# Altium project MP3_RS485.PrjPcb
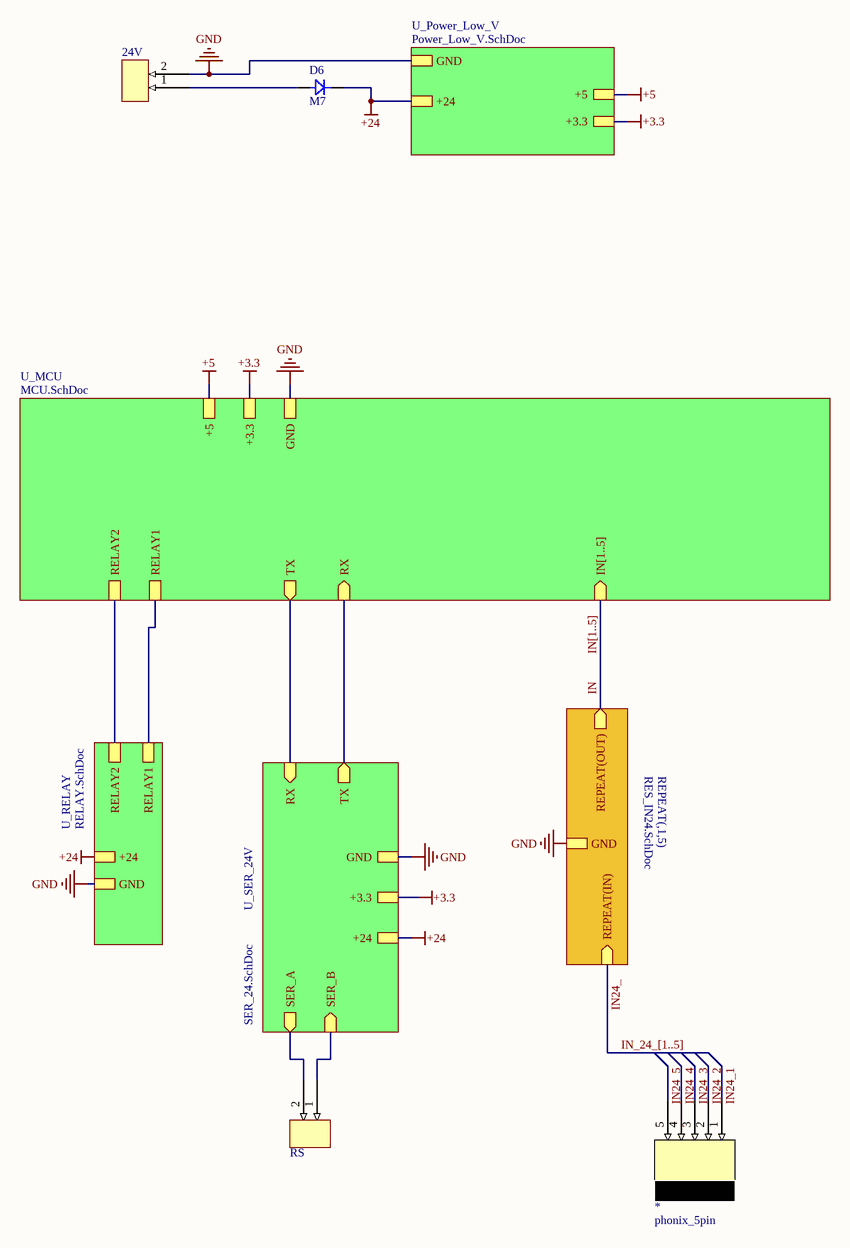
[diagram p0: Multi.SchDoc]
7 sheets, 124 parts. Net scope: hierarchical (ports join the sheet entries above them; power ports are global).
Board file: MP3_RS485.PcbDoc
Sheets:
  Multi.SchDoc
    1 = RES_IN24.SchDoc
    2 = RES_IN24.SchDoc
    3 = RES_IN24.SchDoc
    4 = RES_IN24.SchDoc
    5 = RES_IN24.SchDoc
    U_SER_24V = SER_24.SchDoc
    U_MCU = MCU.SchDoc
      U_MP3 = MP3.SchDoc
    U_Power_Low_V = Power_Low_V.SchDoc
    U_RELAY = RELAY.SchDoc

## Sheet Multi.SchDoc
size 254 x 330 mm

### Parts
24V  (no value)  [CONECTOR/FONIX/2PIN]
D6  M7  [DIOD/1N4007/SMD]
IN  phonix_5pin  [phonix_5pin]
RS  (no value)  [CONECTOR/FONIX/2PIN]

### Sub-sheets
REPEAT(,1,5) = RES_IN24.SchDoc: GND, REPEAT(IN) (in), REPEAT(OUT) (out)
U_MCU = MCU.SchDoc: GND, +5, +3.3, IN[1..5] (in), RX (in), TX (out), RELAY1, RELAY2
U_Power_Low_V = Power_Low_V.SchDoc: GND, +24, +3.3, +5
U_RELAY = RELAY.SchDoc: RELAY1, RELAY2, GND, +24
U_SER_24V = SER_24.SchDoc: SER_A (out), GND, +24, +3.3, TX (out), RX (in), SER_B (in)

### Nets
+3.3: sheet U_SER_24V/+3.3, sheet U_MCU/+3.3, sheet U_Power_Low_V/+3.3
+5: sheet U_MCU/+5, sheet U_Power_Low_V/+5
+24: D6.K ; sheet U_SER_24V/+24, sheet U_Power_Low_V/+24, sheet U_RELAY/+24
GND: 24V.2 ; sheet REPEAT(,1,5)/GND, sheet U_SER_24V/GND, sheet U_MCU/GND, sheet U_Power_Low_V/GND, sheet U_RELAY/GND
IN: sheet REPEAT(,1,5)/REPEAT(OUT)
IN24_: sheet REPEAT(,1,5)/REPEAT(IN)
IN24_1: IN.1
IN24_2: IN.2
IN24_3: IN.3
IN24_4: IN.4
IN24_5: IN.5
RELAY1: sheet U_MCU/RELAY1, sheet U_RELAY/RELAY1
RELAY2: sheet U_MCU/RELAY2, sheet U_RELAY/RELAY2
RX1: sheet U_SER_24V/TX, sheet U_MCU/RX
SER_A: RS.2 ; sheet U_SER_24V/SER_A
SER_B: RS.1 ; sheet U_SER_24V/SER_B
TX1: sheet U_SER_24V/RX, sheet U_MCU/TX
Net24V_1: 24V.1 D6.A

### Buses and harness runs
bus IN[1..5] = sheet U_MCU/IN[1..5]
bus IN_24_[1..5]

### Library data of the parts
24V RS = CONECTOR/FONIX/2PIN
D6 = DIOD/RECTIFIERS

## Sheet RES_IN24.SchDoc
size 127 x 127 mm
Used 5 times, as channels 1, 2, 3, 4, 5. Parts and nets are listed once, with the designators drawn on the sheet.
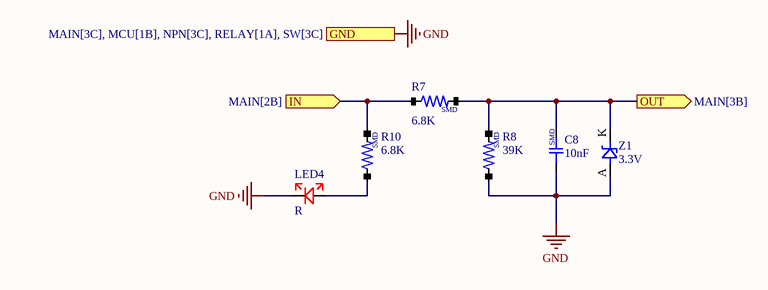
[diagram p1: RES_IN24.SchDoc]

### Parts
C8  10nF  [CAP-0603]
LED4  R  [LED/0805]
R7  6.8K  [RES/0805]
R8  39K  [RES/0805]
R10  6.8K  [RES/0805]
Z1  3.3V  [mini_melf]

### Ports
GND (see MAIN[3C], MCU[1B], NPN[3C], RELAY[1A], SW[3C]), IN (in, see MAIN[2B]), OUT (out, see MAIN[3B])

### Nets
GND: C8.1 LED4.K R8.1 Z1.A ; port GND
IN: R7.1 R10.2 ; port IN
OUT: C8.2 R7.2 R8.2 Z1.K ; port OUT
NetLED4_A: LED4.A R10.1

### Channels
1: designators end in _1; ports GND=GND IN=IN24_1 OUT=IN1
2: designators end in _2; ports GND=GND IN=IN24_2 OUT=IN2
3: designators end in _3; ports GND=GND IN=IN24_3 OUT=IN3
4: designators end in _4; ports GND=GND IN=IN24_4 OUT=IN4
5: designators end in _5; ports GND=GND IN=IN24_5 OUT=IN5

### Notes on the sheet
- (in symbol cap_smd) SMD
- (in symbol RES/SMD) SMD

### Library data of the parts
C8 = cap_smd
LED4 = LED-1COLER
R7 R8 R10 = RES/SMD
Z1 = zener-0.5w

## Sheet SER_24.SchDoc
size A
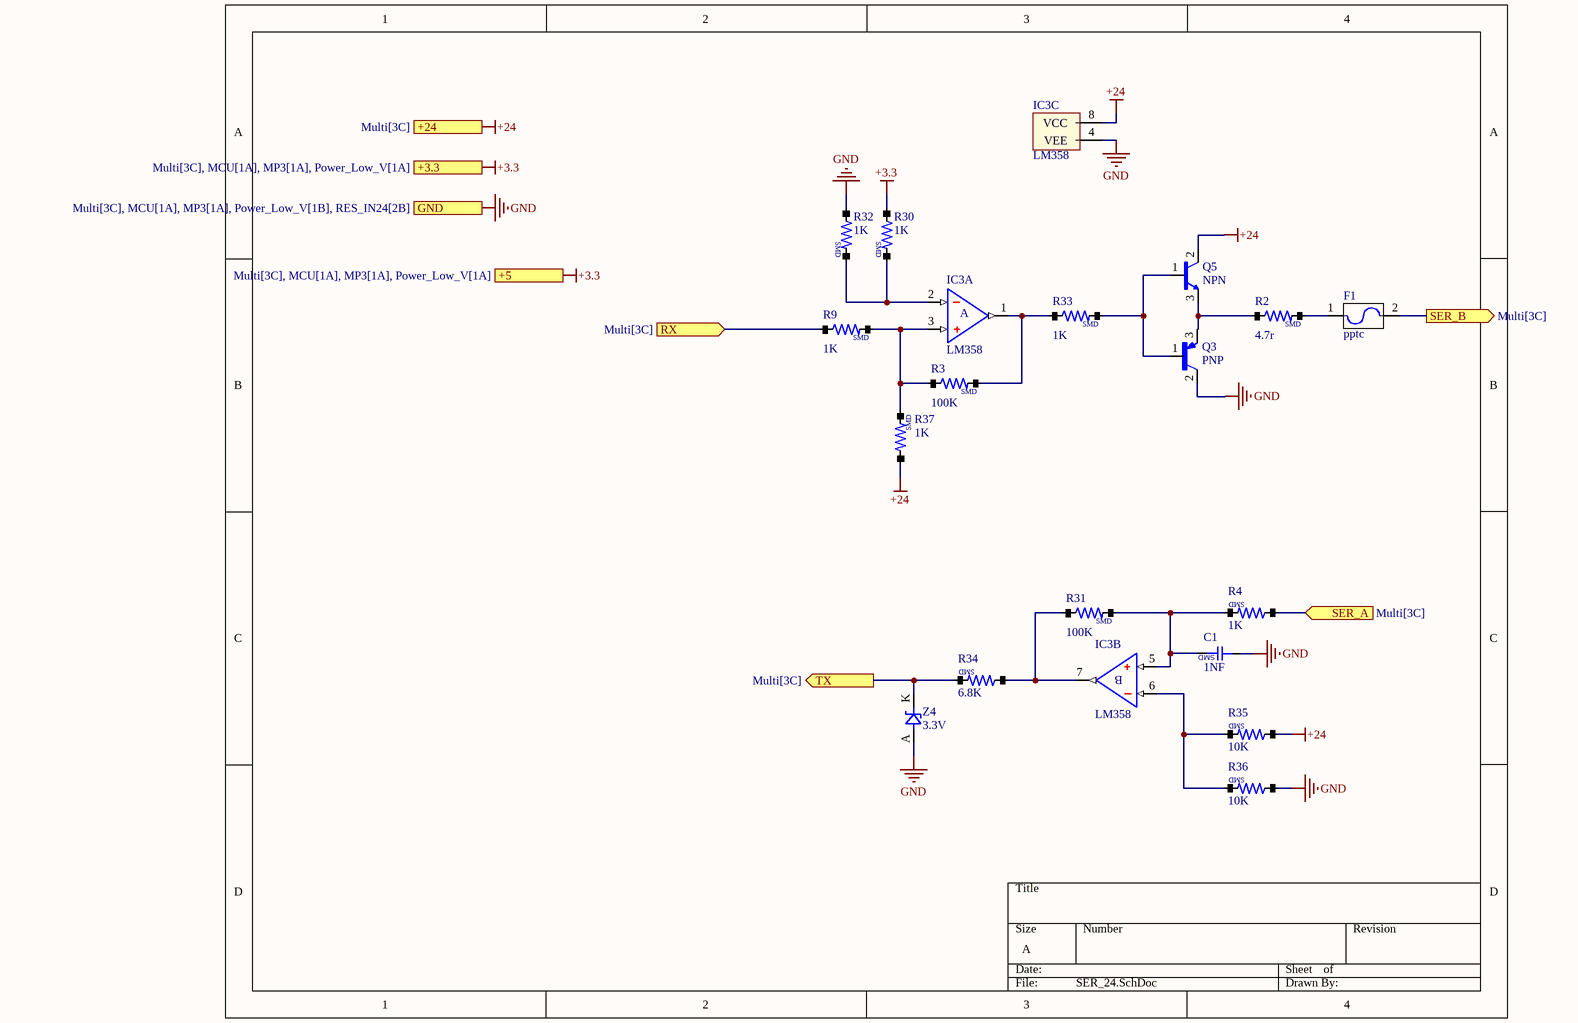
[diagram p2: SER_24.SchDoc]

### Parts
C1  1NF  [CAP-0603]
F1  pptc  [PPTC]
IC3  LM358  [SOP-8]  (parts A,B,C of 3)
Q3  PNP  [SOT-89]
Q5  NPN  [SOT-89]
R2  4.7r  [RES/0805]
R3  100K  [RES/0603]
R4  1K  [RES/0603]
R9  1K  [RES/0603]
R30  1K  [RES/0603]
R31  100K  [RES/0603]
R32  1K  [RES/0603]
R33  1K  [RES/0603]
R34  6.8K  [RES/0805]
R35  10K  [RES/0603]
R36  10K  [RES/0603]
R37  1K  [RES/0603]
Z4  3.3V  [DIOD/RS1J]

### Ports
+3.3 (see Multi[3C], MCU[1A], MP3[1A], Power_Low_V[1A]), +5 (see Multi[3C], MCU[1A], MP3[1A], Power_Low_V[1A]), +24 (see Multi[3C]), GND (see Multi[3C], MCU[1A], MP3[1A], Power_Low_V[1B], RES_IN24[2B]), RX (in, see Multi[3C]), SER_A (in, see Multi[3C]), SER_B (out, see Multi[3C]), TX (out, see Multi[3C])

### Nets
+3.3: R30.1 ; port +3.3, port +5
+24: IC3.8(VCC) Q5.2(C) R35.1 R37.1 ; port +24
GND: C1.1 IC3.4(VEE) Q3.2(C) R32.1 R36.1 Z4.A ; port GND
RX1: R34.2 Z4.K ; port TX
SER_A: R4.1 ; port SER_A
SER_B: F1.2 ; port SER_B
TX1: R9.1 ; port RX
NetC1_2: C1.2 IC3.5 R4.2 R31.2
NetF1_1: F1.1 R2.2
NetIC3_1: IC3.1 R3.2 R33.1
NetIC3_2: IC3.2 R30.2 R32.2
NetIC3_3: IC3.3 R3.1 R9.2 R37.2
NetIC3_6: IC3.6 R35.2 R36.2
NetIC3_7: IC3.7 R31.1 R34.1
NetQ3_1: Q3.1(B) Q5.1(B) R33.2
NetQ3_3: Q3.3(E) Q5.3(E) R2.1

### Notes on the sheet
- (in symbol cap_smd) SMD
- (in symbol LM358, part A) A
- (in symbol LM358, part B) B
- (in symbol RES/SMD) SMD

### Library data of the parts
C1 = cap_smd
F1 = fuze
R2-R4 R9 R30-R37 = RES/SMD
Z4 = zener-0.5w

## Sheet MCU.SchDoc
size 304 x 254 mm
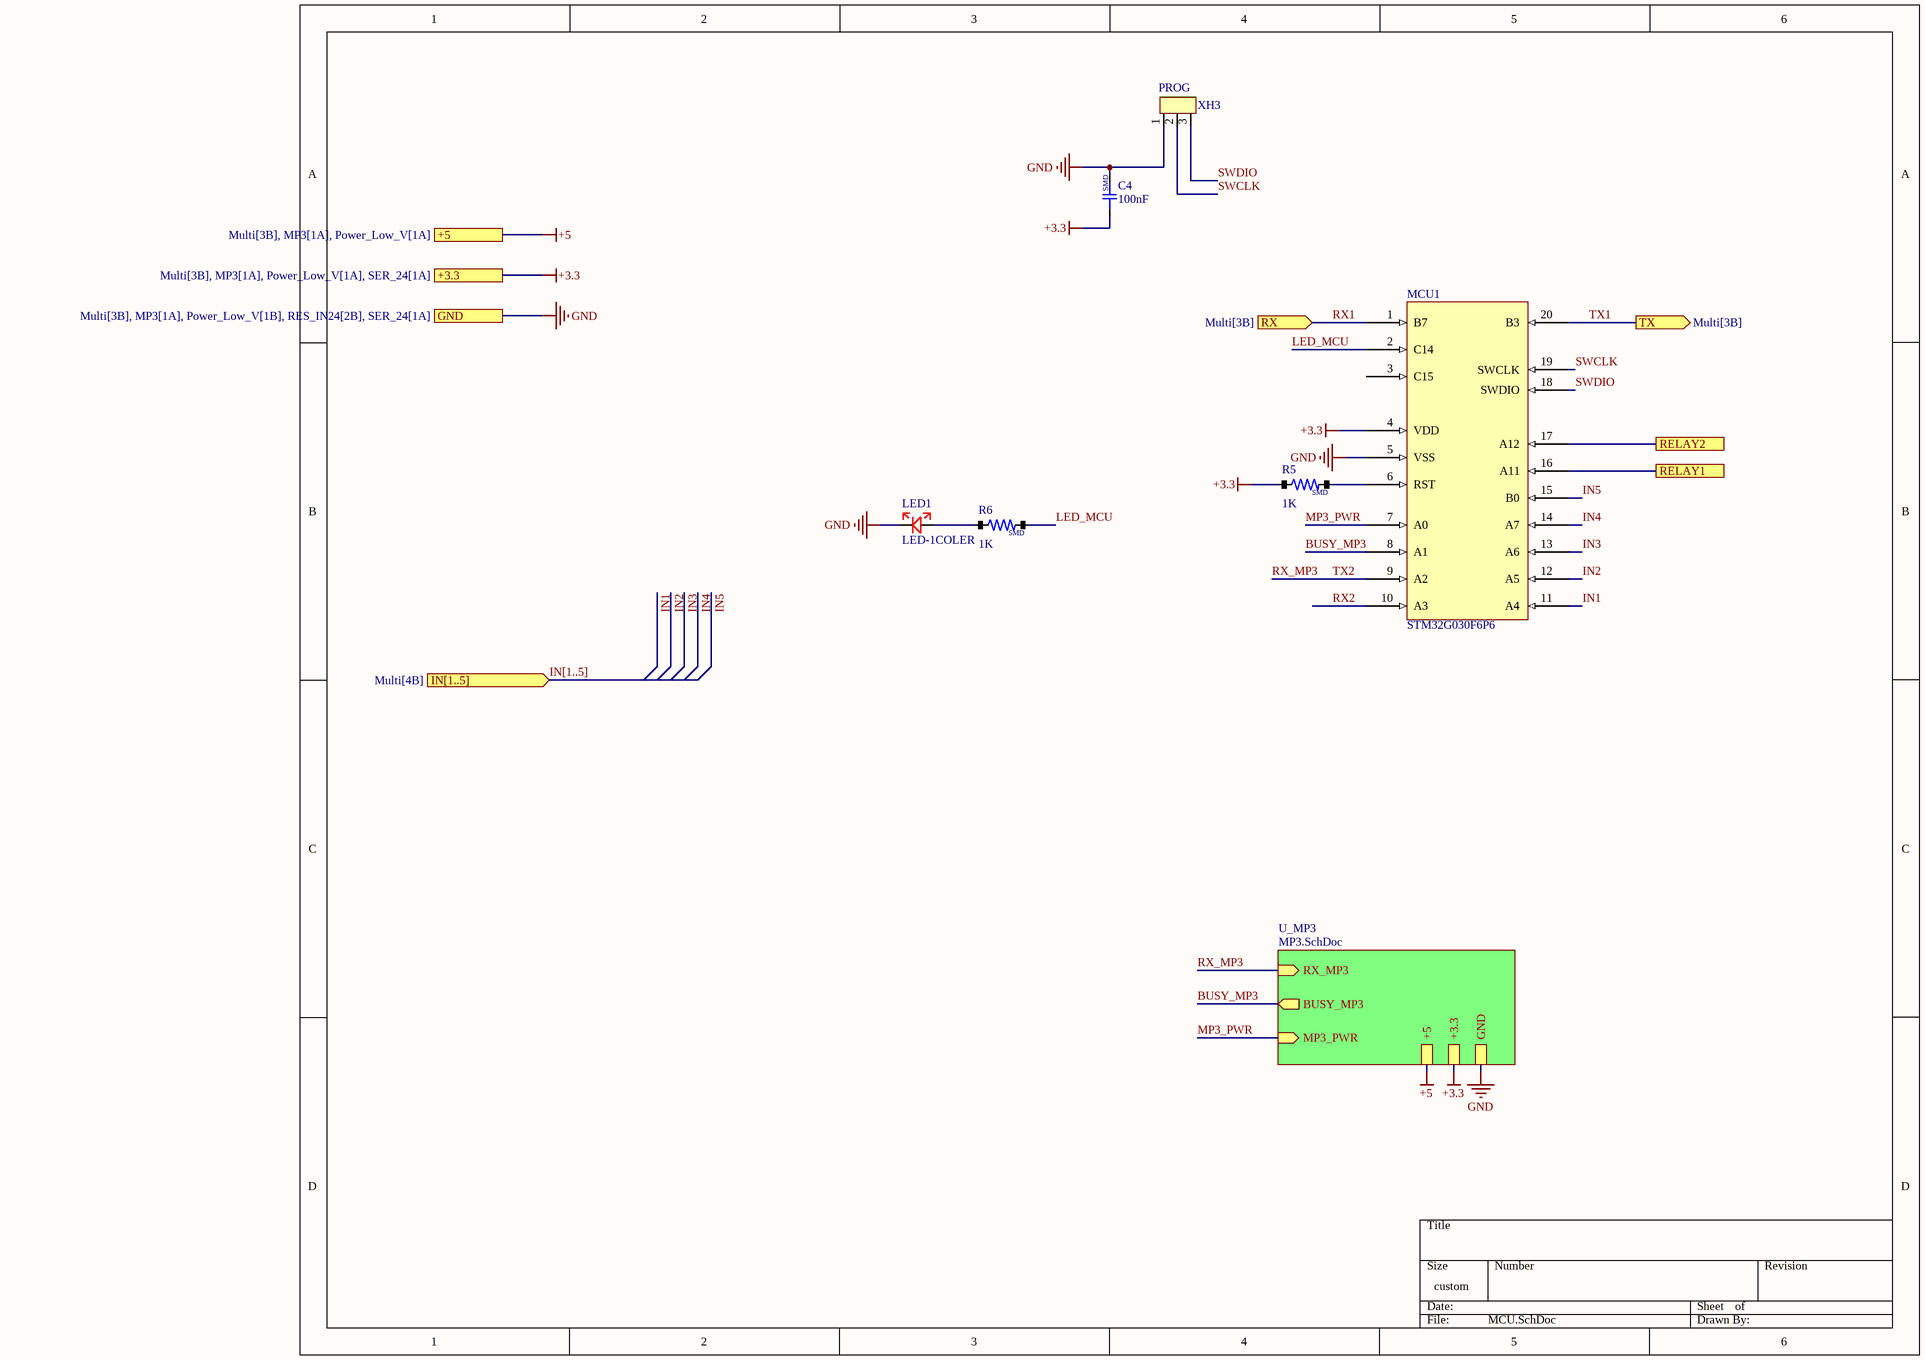
[diagram p3: MCU.SchDoc]

### Parts
C4  100nF  [CAP-0603]
LED1  LED-1COLER  [LED/0805]
MCU1  STM32G030F6P6  [stm32G030F6P6]
PROG  XH3  [XH3]
R5  1K  [RES/0603]
R6  1K  [RES/0603]

### Sub-sheets
U_MP3 = MP3.SchDoc: +3.3, GND, +5, MP3_PWR (in), RX_MP3 (in), BUSY_MP3 (out)

### Ports
+3.3 (see Multi[3B], MP3[1A], Power_Low_V[1A], SER_24[1A]), +5 (see Multi[3B], MP3[1A], Power_Low_V[1A]), GND (see Multi[3B], MP3[1A], Power_Low_V[1B], RES_IN24[2B], SER_24[1A]), IN[1..5] (in, see Multi[4B]), RELAY1, RELAY2, RX (in, see Multi[3B]), TX (out, see Multi[3B])

### Nets
+3.3: C4.1 MCU1.4(VDD) R5.1 ; port +3.3, sheet U_MP3/+3.3
+5: port +5, sheet U_MP3/+5
GND: C4.2 LED1.K MCU1.5(VSS) PROG.1 ; port GND, sheet U_MP3/GND
BUSY_MP3: MCU1.8(A1) ; sheet U_MP3/BUSY_MP3
IN1: MCU1.11(A4)
IN2: MCU1.12(A5)
IN3: MCU1.13(A6)
IN4: MCU1.14(A7)
IN5: MCU1.15(B0)
LED_MCU: MCU1.2(C14) R6.2
MP3_PWR: MCU1.7(A0) ; sheet U_MP3/MP3_PWR
RELAY1: MCU1.16(A11) ; port RELAY1
RELAY2: MCU1.17(A12) ; port RELAY2
RX1: MCU1.1(B7) ; port RX
RX2: MCU1.10(A3)
RX_MP3: MCU1.9(A2) ; sheet U_MP3/RX_MP3  [also labelled TX2]
SWCLK: MCU1.19(SWCLK) PROG.2
SWDIO: MCU1.18(SWDIO) PROG.3
TX1: MCU1.20(B3) ; port TX
NetLED1_A: LED1.A R6.1
NetMCU1_6: MCU1.6(RST) R5.2

Not connected (* = marked no-connect by the designer): MCU1 3(C15)

### Buses and harness runs
bus IN[1..5] = port IN[1..5]

### Notes on the sheet
- (in symbol cap_smd) SMD
- (in symbol RES/SMD) SMD

### Library data of the parts
C4 = cap_smd
R5 R6 = RES/SMD

## Sheet MP3.SchDoc
size 381 x 241 mm
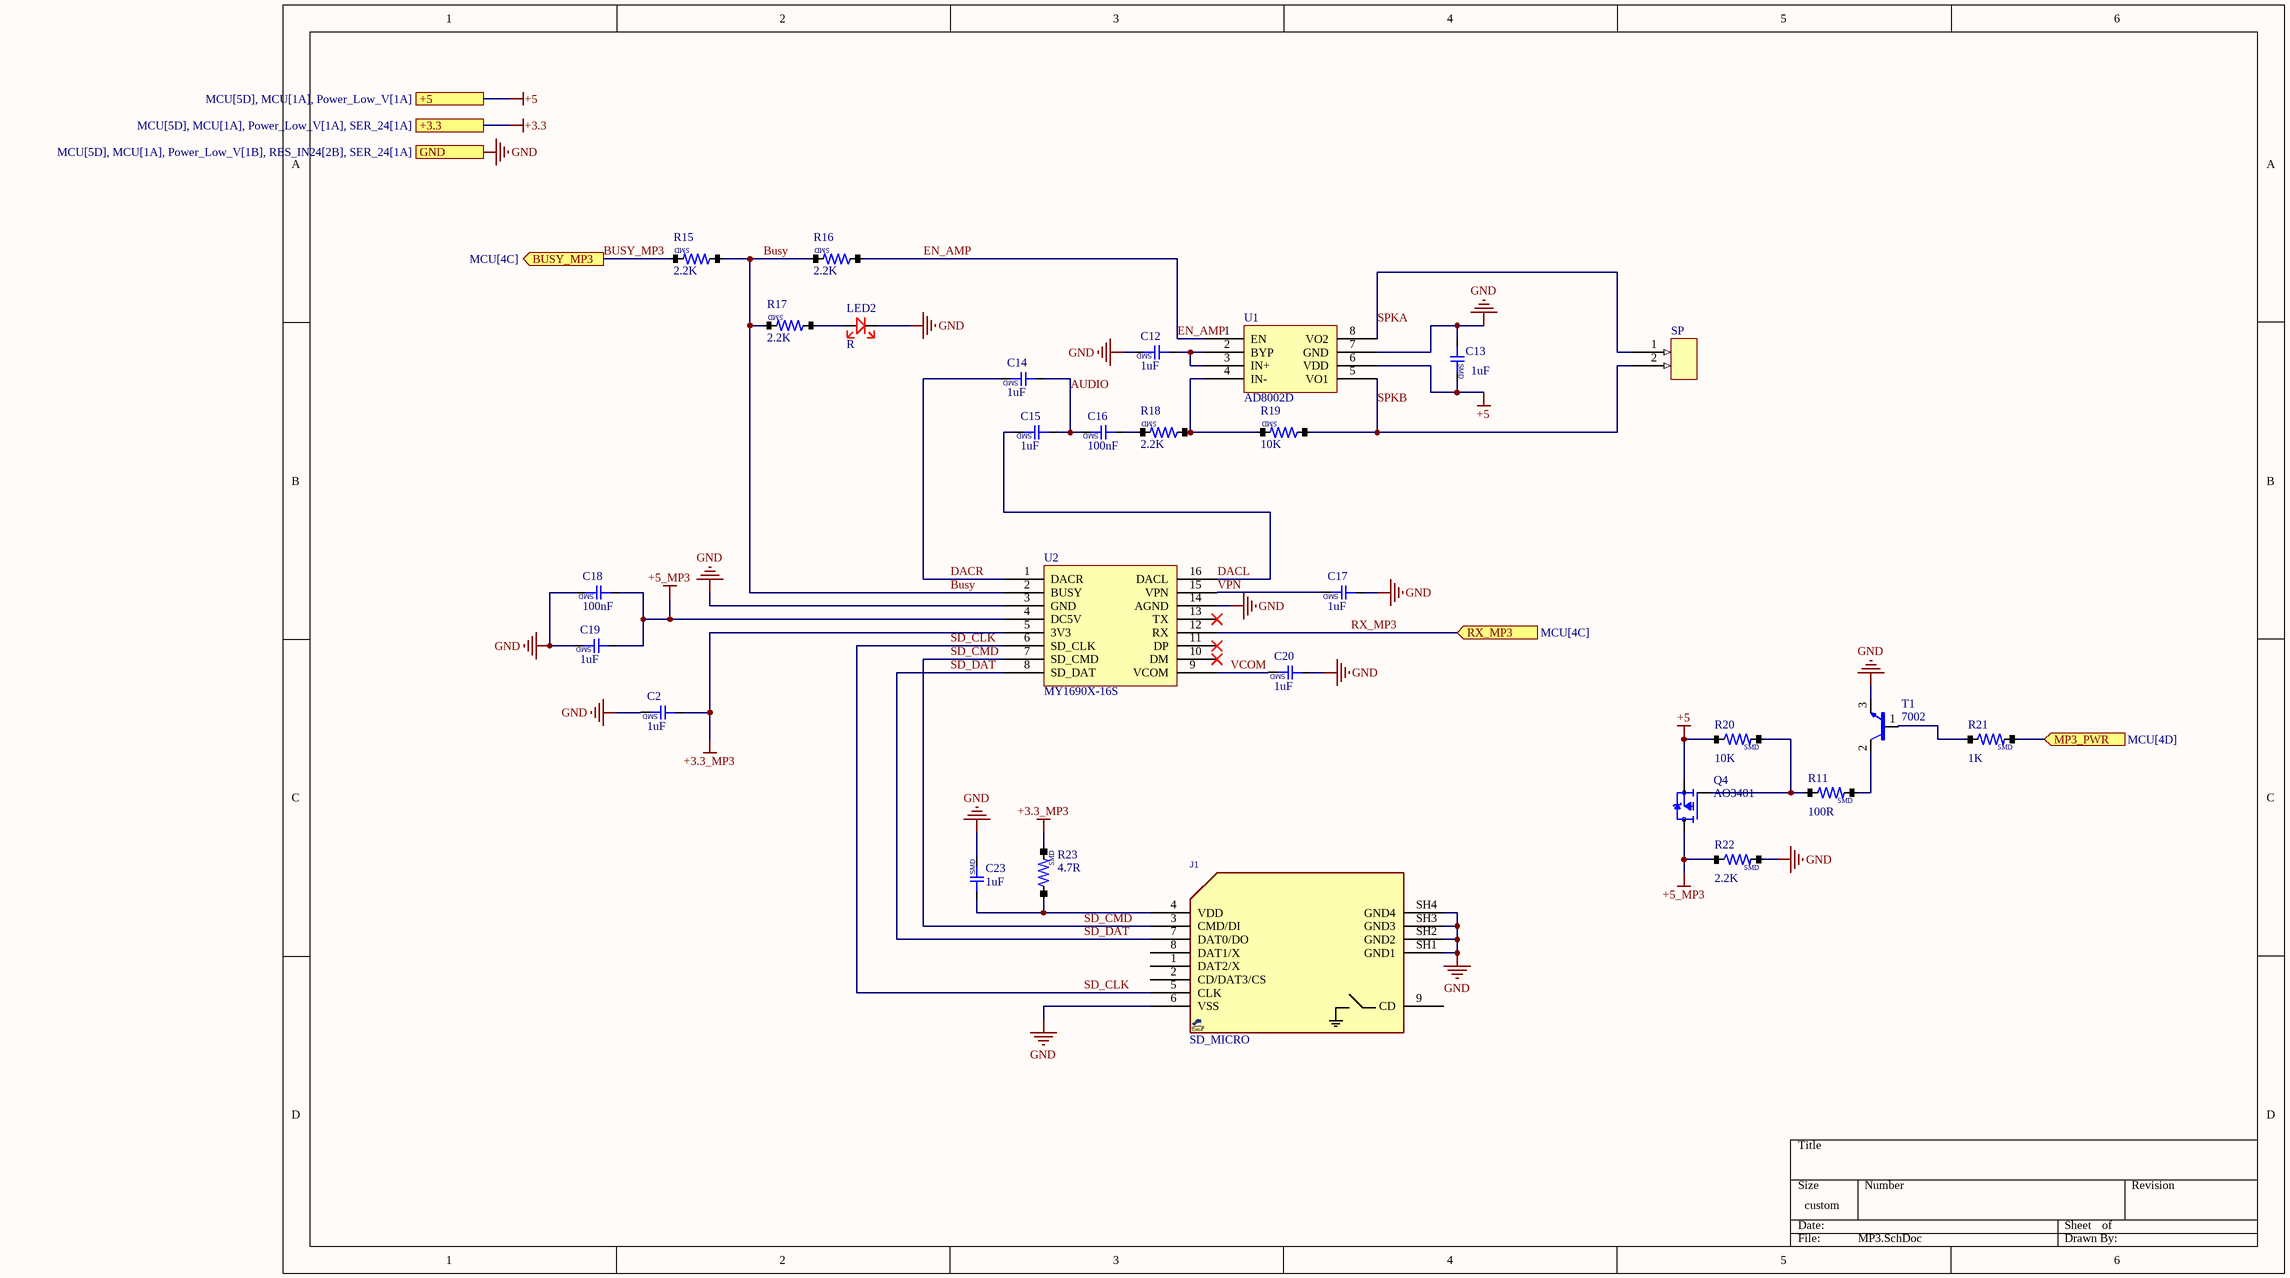
[diagram p4: MP3.SchDoc]

### Parts
C2  1uF  [CAP-0805]
C12  1uF  [CAP-0805]
C13  1uF  [CAP-0805]
C14  1uF  [CAP-0603]
C15  1uF  [CAP-0603]
C16  100nF  [CAP-0603]
C17  1uF  [CAP-0805]
C18  100nF  [CAP-0603]
C19  1uF  [CAP-0805]
C20  1uF  [CAP-0805]
C23  1uF  [CAP-0805]
J1  SD_MICRO  [MEMORY_RAVIS]
LED2  R  [LED/0805]
Q4  AO3401  [AO3401A]
R11  100R  [RES/0603]
R15  2.2K  [RES/0603]
R16  2.2K  [RES/0603]
R17  2.2K  [RES/0603]
R18  2.2K  [RES/0603]
R19  10K  [RES/0603]
R20  10K  [RES/0603]
R21  1K  [RES/0603]
R22  2.2K  [RES/0603]
R23  4.7R  [RES/0805]
SP  CONECTOR/FONIX/2PIN  [CONECTOR/FONIX/2PIN]  (value not drawn)
T1  7002  [SOT23]
U1  AD8002D  [SOP-8]
U2  MY1690X-16S  [TL494_SMD]

### Ports
+3.3 (see MCU[5D], MCU[1A], Power_Low_V[1A], SER_24[1A]), +5 (see MCU[5D], MCU[1A], Power_Low_V[1A]), BUSY_MP3 (out, see MCU[4C]), GND (see MCU[5D], MCU[1A], Power_Low_V[1B], RES_IN24[2B], SER_24[1A]), MP3_PWR (in, see MCU[4D]), RX_MP3 (in, see MCU[4C])

### Nets
+3.3_MP3: C2.1 R23.2 U2.5(3V3)
+5: C13.2 Q4.S R20.1 U1.6(VDD) ; port +5
+5_MP3: C18.1 C19.1 Q4.D R22.1 U2.4(DC5V)
GND: C2.2 C12.2 C13.1 C17.1 C18.2 C19.2 C20.1 C23.2 J1.6(VSS) J1.SH1(GND1) J1.SH2(GND2) J1.SH3(GND3) J1.SH4(GND4) LED2.K R22.2 T1.3(E) U1.7(GND) U2.3(GND) U2.14(AGND) ; port GND
AUDIO: C14.1 C15.1 C16.2
Busy: R15.1 R16.2 R17.2 U2.2(BUSY)
BUSY_MP3: R15.2 ; port BUSY_MP3
DACL: C15.2 U2.16(DACL)
DACR: C14.2 U2.1(DACR)
EN_AMP: R16.1 U1.1(EN)
MP3_PWR: R21.2 ; port MP3_PWR
RX_MP3: U2.12(RX) ; port RX_MP3
SD_CLK: J1.5(CLK) U2.6(SD_CLK)
SD_CMD: J1.3(CMD/DI) U2.7(SD_CMD)
SD_DAT: J1.7(DAT0/DO) U2.8(SD_DAT)
SPKA: SP.1 U1.8(VO2)
SPKB: R19.1 SP.2 U1.5(VO1)
VCOM: C20.2 U2.9(VCOM)
VPN: C17.2 U2.15(VPN)
NetC12_1: C12.1 U1.2(BYP) U1.3(IN+)
NetC16_1: C16.1 R18.2
NetC23_1: C23.1 J1.4(VDD) R23.1
NetLED2_A: LED2.A R17.1
NetQ4_G: Q4.G R11.1 R20.2
NetR11_2: R11.2 T1.2(C)
NetR18_1: R18.1 R19.2 U1.4(IN-)
NetR21_1: R21.1 T1.1(B)

Not connected (* = marked no-connect by the designer): J1 1(DAT2/X) 2(CD/DAT3/CS) 8(DAT1/X) 9(CD); U2 10(DM)* 11(DP)* 13(TX)*

### Notes on the sheet
- (in symbol cap_smd) SMD
- (in symbol RES/SMD) SMD

### Library data of the parts
C2 C12-C20 C23 = cap_smd
J1 = SOCKET_SDMICRO_AT: SD MICRO exist in Iran, Attend 112J-TDAR-R01; PARAM: push-push; MANF: Attend; MANF_P#: 112J-TDAR-R01; VALUE: SD_MICRO
LED2 = LED-1COLER
Q4 = MOSFET_P_CH
R11 R15-R23 = RES/SMD
T1 = NPN
U2 = MY1690X-16S: IC, MP3 Player

## Sheet Power_Low_V.SchDoc
size A
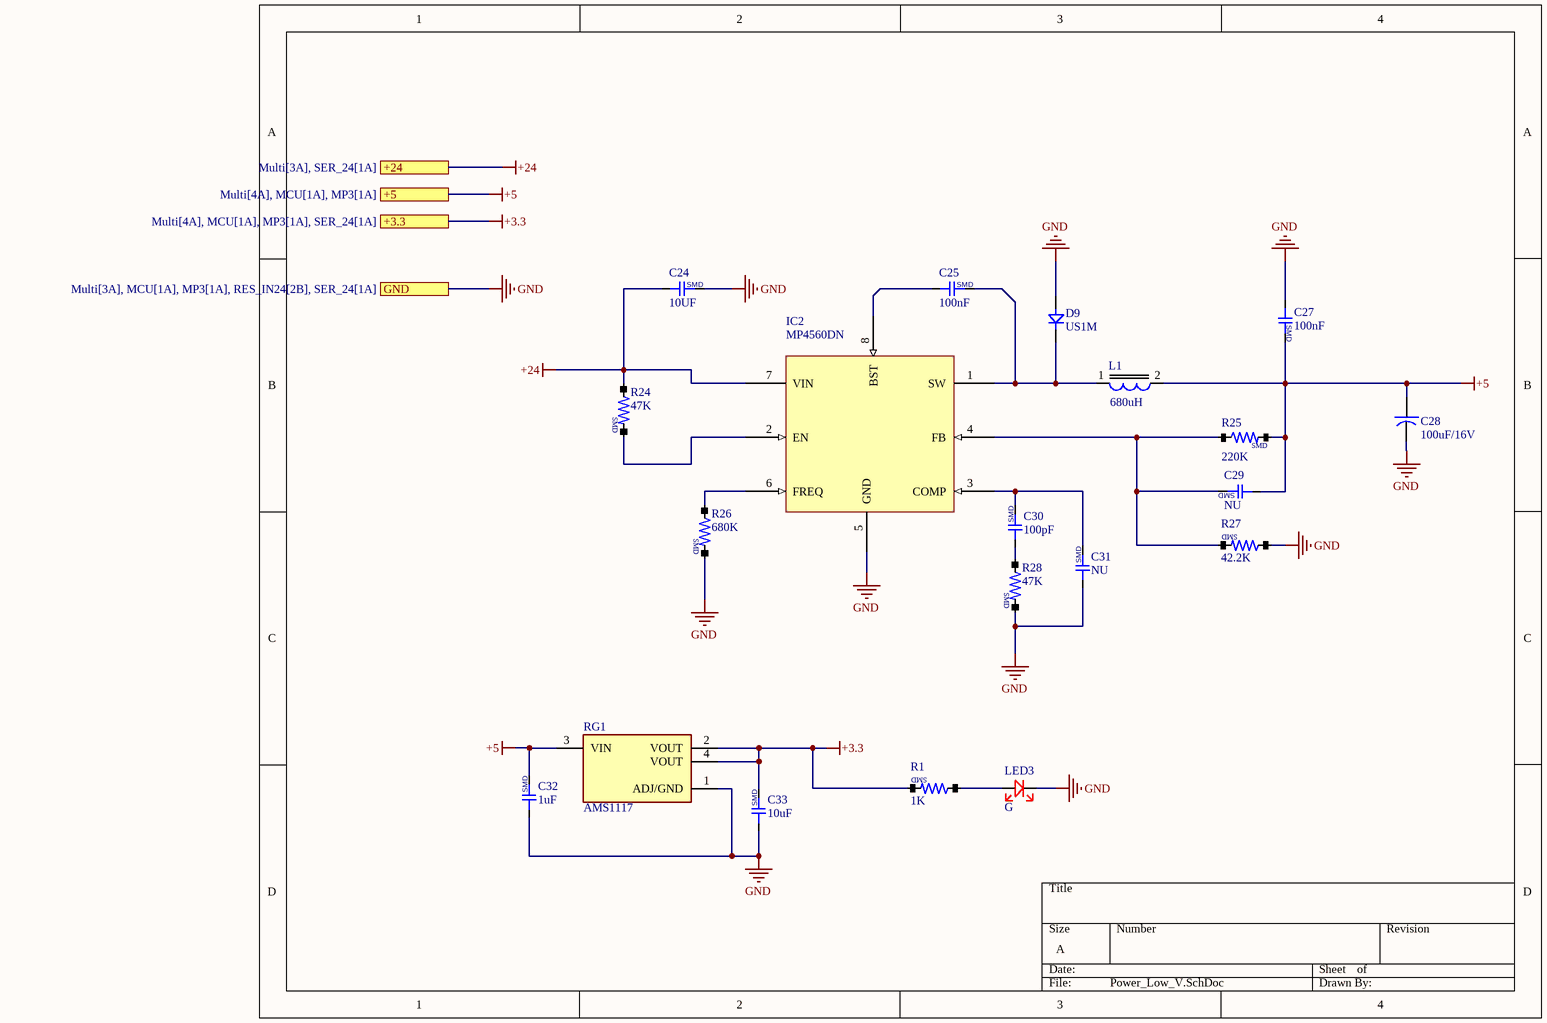
[diagram p5: Power_Low_V.SchDoc]

### Parts
C24  10UF  [CAP-1206]
C25  100nF  [CAP-0603]
C27  100nF  [CAP-0603]
C28  100uF/16V  [CAP-EL-P100mil]
C29  NU  [CAP-0603]
C30  100pF  [CAP-0603]
C31  NU  [CAP-0603]
C32  1uF  [CAP-0805]
C33  10uF  [CAP-0805]
D9  US1M  [DIOD/1N4007/SMD]
IC2  MP4560DN  [SOP8_HIT]
L1  680uH  [NR6028T680]
LED3  G  [LED/0805]
R1  1K  [RES/0603]
R24  47K  [RES/0603]
R25  220K  [RES/0603]
R26  680K  [RES/0805]
R27  42.2K  [RES/0603]
R28  47K  [RES/0603]
RG1  AMS1117  [AMS1117]

### Ports
+3.3 (see Multi[4A], MCU[1A], MP3[1A], SER_24[1A]), +5 (see Multi[4A], MCU[1A], MP3[1A]), +24 (see Multi[3A], SER_24[1A]), GND (see Multi[3A], MCU[1A], MP3[1A], RES_IN24[2B], SER_24[1A])

### Nets
+3.3: C33.2 R1.2 RG1.2(VOUT) RG1.4(VOUT) ; port +3.3
+5: C27.2 C28.+ C29.1 C32.2 L1.2 R25.2 RG1.3(VIN) ; port +5
+24: C24.1 IC2.7(VIN) R24.1 ; port +24
GND: C24.2 C27.1 C28.- C31.1 C32.1 C33.1 D9.A IC2.5(GND) LED3.K R26.2 R27.1 R28.2 RG1.1(ADJ/GND) ; port GND
NetC25_1: C25.1 IC2.8(BST)
NetC25_2: C25.2 D9.K IC2.1(SW) L1.1
NetC29_2: C29.2 IC2.4(FB) R25.1 R27.2
NetC30_1: C30.1 R28.1
NetC30_2: C30.2 C31.2 IC2.3(COMP)
NetIC2_2: IC2.2(EN) R24.2
NetIC2_6: IC2.6(FREQ) R26.1
NetLED3_A: LED3.A R1.1

### Notes on the sheet
- (in symbol cap_smd) SMD
- (in symbol RES/SMD) SMD

### Library data of the parts
C24 C25 C27 C29-C33 = cap_smd
C28 = cap-electrolit
D9 = DIOD/RECTIFIERS
L1 = inductor
LED3 = LED-1COLER
R1 R24-R28 = RES/SMD

## Sheet RELAY.SchDoc
size A
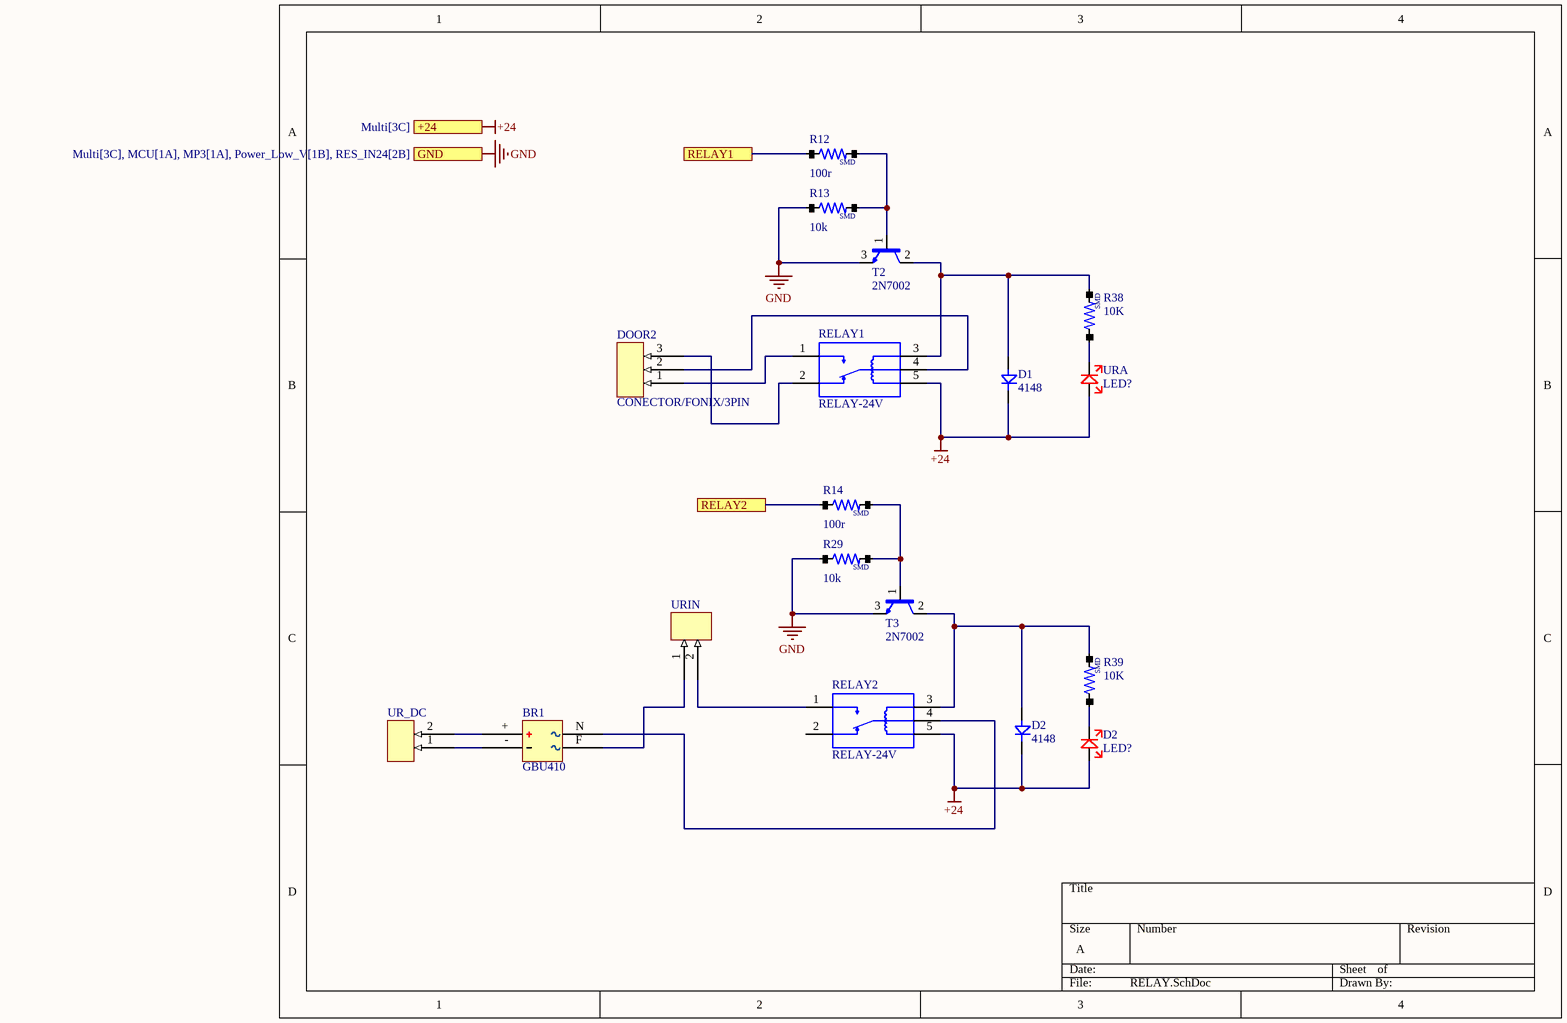
[diagram p6: RELAY.SchDoc]

### Parts
(Parts that share a designator on the sheet are numbered #1, #2 ... from top to bottom, then left to right.)
BR1  GBU410  [BRIDGE_GBU410]
D1  4148  [mini_melf]
D2#1  4148  [mini_melf]
D2#2  LED?  [LED/0805]
DOOR2  CONECTOR/FONIX/3PIN  [CONECTOR/FONIX/3PIN]
R12  100r  [RES/0603]
R13  10k  [RES/0603]
R14  100r  [RES/0603]
R29  10k  [RES/0603]
R38  10K  [RES/0603]
R39  10K  [RES/0603]
RELAY1  RELAY-24V  [RELAY-5V]
RELAY2  RELAY-24V  [RELAY-5V]
T2  2N7002  [SOT23]
T3  2N7002  [SOT23]
UR_DC  (no value)  [CONECTOR/FONIX/2PIN]
URA  LED?  [LED/0805]
URIN  (no value)  [CONECTOR/FONIX/2PIN]

### Ports
+24 (see Multi[3C]), GND (see Multi[3C], MCU[1A], MP3[1A], Power_Low_V[1B], RES_IN24[2B]), RELAY1, RELAY2

### Nets
+24: D1.K D2#1.K D2#2.A RELAY1.5(C2) RELAY2.5(C2) URA.A ; port +24
GND: R13.1 R29.1 T2.3(E) T3.3(E) ; port GND
RELAY1: R12.1 ; port RELAY1
RELAY2: R14.1 ; port RELAY2
NetBR1_+: BR1.+ UR_DC.2
NetBR1_-: BR1.- UR_DC.1
NetBR1_F: BR1.F URIN.1
NetBR1_N: BR1.N RELAY2.4(C)
NetD1_A: D1.A R38.2 RELAY1.3(C1) T2.2(C)
NetD2#1_A: D2#1.A R39.2 RELAY2.3(C1) T3.2(C)
NetD2#2_K: D2#2.K R39.1
NetDOOR2_1: DOOR2.1 RELAY1.1(NO)
NetDOOR2_2: DOOR2.2 RELAY1.4(C)
NetDOOR2_3: DOOR2.3 RELAY1.2(NC)
NetR12_2: R12.2 R13.2 T2.1(B)
NetR14_2: R14.2 R29.2 T3.1(B)
NetR38_1: R38.1 URA.K
NetRELAY2_1: RELAY2.1(NO) URIN.2

Not connected (* = marked no-connect by the designer): RELAY2 2(NC)

### Notes on the sheet
- (in symbol RES/SMD) SMD

### Library data of the parts
BR1 = BRIDGE RECTIFIERS
D1 D2#1 = DIOD/RECTIFIERS
D2#2 URA = LED-1COLER
R12-R14 R29 R38 R39 = RES/SMD
RELAY1 RELAY2 = RELAY-5V
T2 T3 = NPN
UR_DC URIN = CONECTOR/FONIX/2PIN

## Nets that join several sheets
+3.3: SER_24 (R30.1), MCU (C4.1 MCU1.4 R5.1), Power_Low_V (C33.2 R1.2 RG1.2 RG1.4)
+5: MP3 (C13.2 Q4.S R20.1 U1.6), Power_Low_V (7 pins)
+24: Multi (D6.K), SER_24 (IC3.8 Q5.2 R35.1 R37.1), Power_Low_V (C24.1 IC2.7 R24.1), RELAY (6 pins)
GND: Multi (24V.2), 1 (C8_1.1 LED4_1.K R8_1.1 Z1_1.A), 2 (C8_2.1 LED4_2.K R8_2.1 Z1_2.A), 3 (C8_3.1 LED4_3.K R8_3.1 Z1_3.A), 4 (C8_4.1 LED4_4.K R8_4.1 Z1_4.A), 5 (C8_5.1 LED4_5.K R8_5.1 Z1_5.A), SER_24 (6 pins), MCU (C4.2 LED1.K MCU1.5 PROG.1), MP3 (19 pins), Power_Low_V (13 pins), RELAY (R13.1 R29.1 T2.3 T3.3)
BUSY_MP3: MCU (MCU1.8), MP3 (R15.2)
IN1: 1 (C8_1.2 R7_1.2 R8_1.2 Z1_1.K), MCU (MCU1.11)
IN2: 2 (C8_2.2 R7_2.2 R8_2.2 Z1_2.K), MCU (MCU1.12)
IN3: 3 (C8_3.2 R7_3.2 R8_3.2 Z1_3.K), MCU (MCU1.13)
IN4: 4 (C8_4.2 R7_4.2 R8_4.2 Z1_4.K), MCU (MCU1.14)
IN5: 5 (C8_5.2 R7_5.2 R8_5.2 Z1_5.K), MCU (MCU1.15)
IN24_1: Multi (IN.1), 1 (R7_1.1 R10_1.2)
IN24_2: Multi (IN.2), 2 (R7_2.1 R10_2.2)
IN24_3: Multi (IN.3), 3 (R7_3.1 R10_3.2)
IN24_4: Multi (IN.4), 4 (R7_4.1 R10_4.2)
IN24_5: Multi (IN.5), 5 (R7_5.1 R10_5.2)
MP3_PWR: MCU (MCU1.7), MP3 (R21.2)
RELAY1: MCU (MCU1.16), RELAY (R12.1)
RELAY2: MCU (MCU1.17), RELAY (R14.1)
RX1: SER_24 (R34.2 Z4.K), MCU (MCU1.1)
RX_MP3: MCU (MCU1.9), MP3 (U2.12)
SER_A: Multi (RS.2), SER_24 (R4.1)
SER_B: Multi (RS.1), SER_24 (F1.2)
TX1: SER_24 (R9.1), MCU (MCU1.20)